# EAGLE design MRCS-BBProMini (EAGLE 7.7.0)
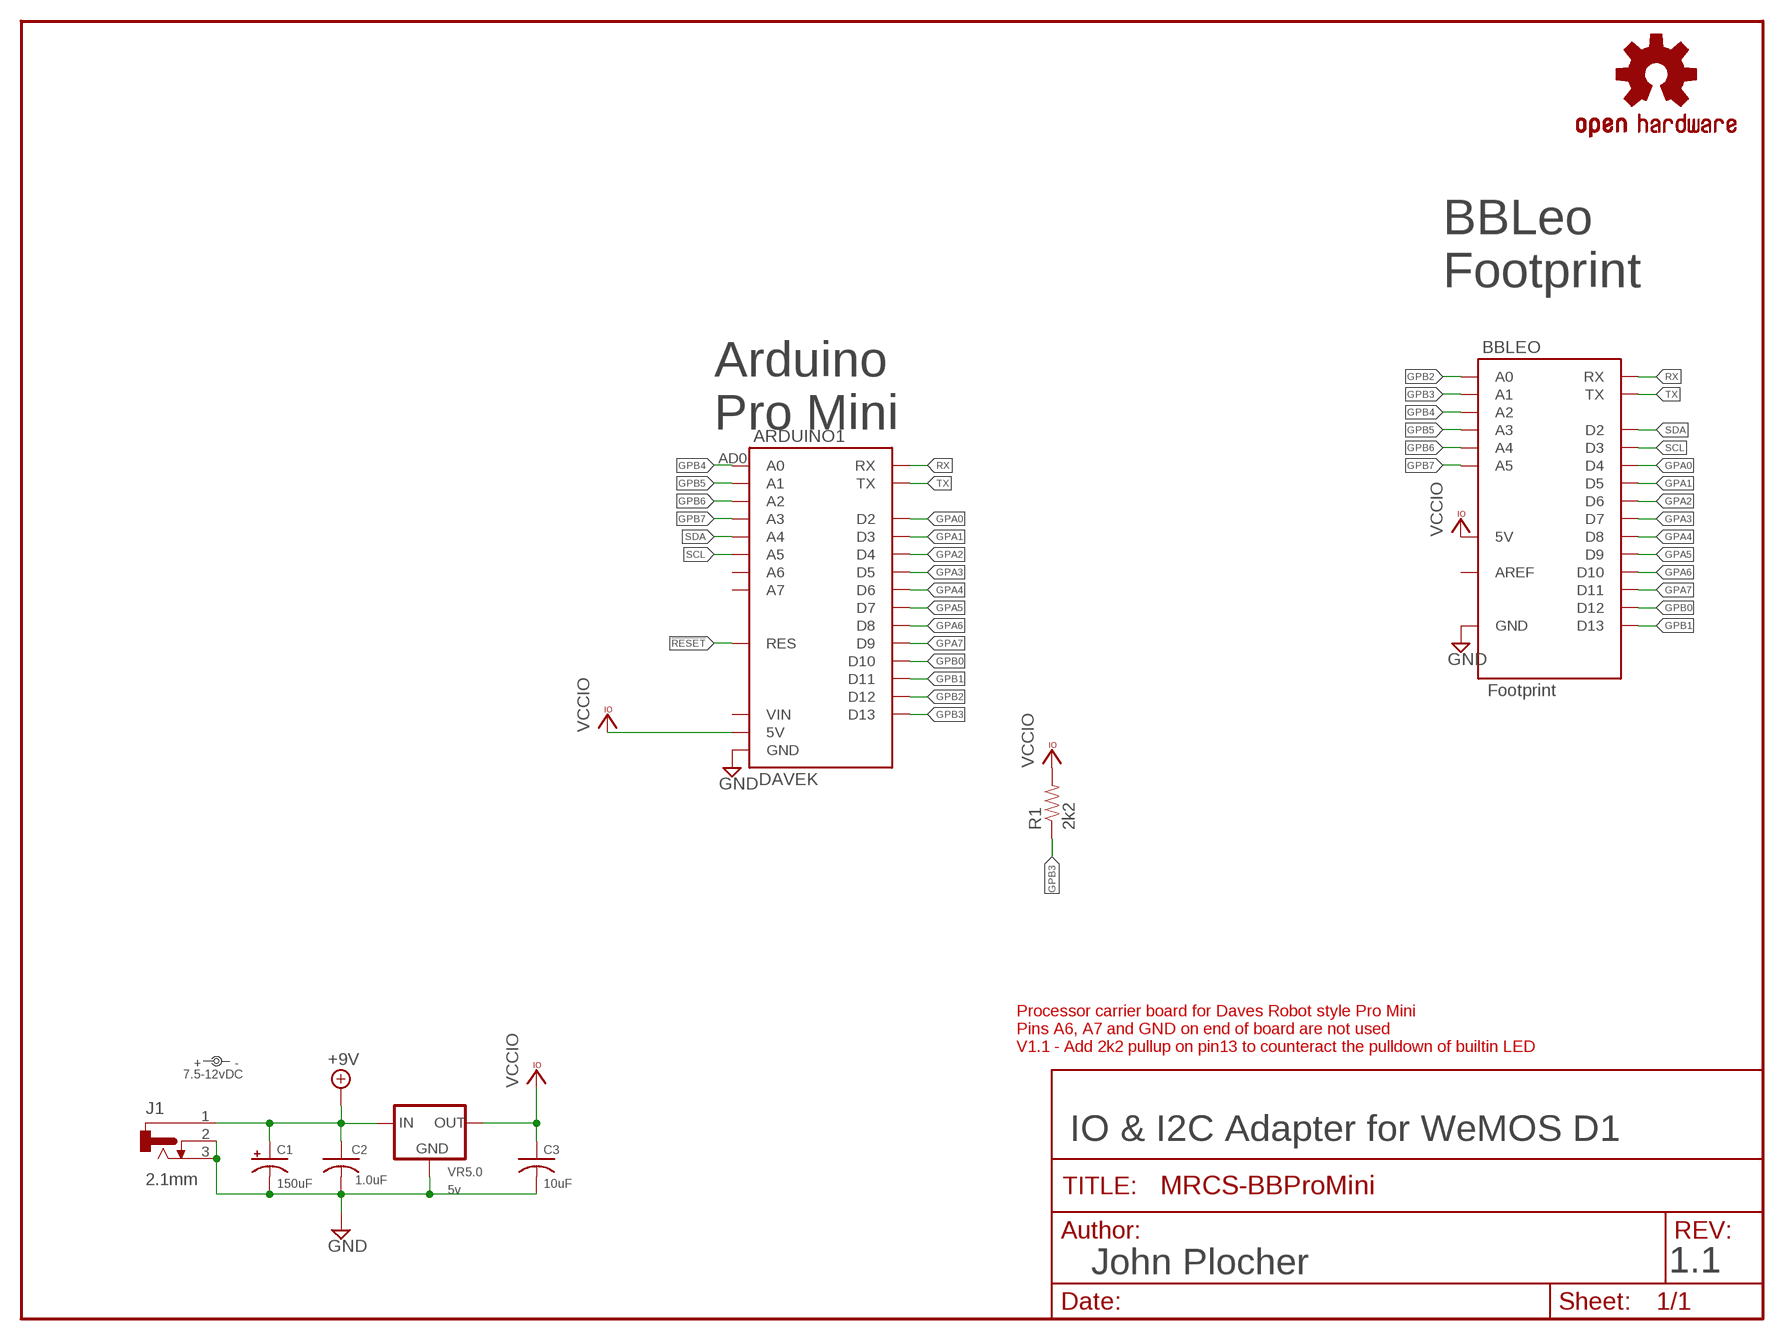
[diagram p0: schematic, sheet 1]

## Parts
ARDUINO1  DAVEK  ARDUINO-PRO-MINIDAVESROBOT  [ARDUINO_PRO_MINI_DAVEK]
BBLEO  Footprint  ARDUINO-BBLEO  [ARDUINO-BBLEO]
C1  150uF  CAP-POLPTH-5MM  [E5-10.5]
C2  1.0uF  CAPPTH1  [C050-024X044]
C3  10uF  CAPPTH1  [C050-024X044]
J1  2.1mm  CONNECTOR-DC-POWER-RA  [DCJ0202]
LABEL1  7.5-12vDC  DOC-POWER_LABEL  [PWR_LABEL]
OSHW1  OSHW  DOC-OSHW-LOGO-M  [OSHW-LOGO-M]
R1  2k2  RPTH03  [AXIAL-0.3-RES]
VR5.0  5v  VREG-PTH-RA-  [TO-220-RA]

## Nets
!RESET: ARDUINO1.RES ARDUINO1.RES@1(RES)
+9V [Feed]: C1.+ C2.1 J1.1 VR5.0.IN
GND [signals]: ARDUINO1.GND@1(GND) ARDUINO1.GND@2(GND) ARDUINO1.GND@4(GND) BBLEO.GND@0(GND) BBLEO.GND@1(GND) BBLEO.GND@2(GND) BBLEO.GND@3(GND) BBLEO.GND@4(GND) C1.- C2.2 C3.2 J1.2 J1.3 VR5.0.GND
GPA0: ARDUINO1.D2 BBLEO.D4
GPA1: ARDUINO1.D3 BBLEO.D5
GPA2: ARDUINO1.D4 BBLEO.D6
GPA3: ARDUINO1.D5 BBLEO.D7
GPA4: ARDUINO1.D6 BBLEO.D8
GPA5: ARDUINO1.D7 BBLEO.D9
GPA6: ARDUINO1.D8 BBLEO.D10
GPA7: ARDUINO1.D9 BBLEO.D11
GPB0: ARDUINO1.D10 BBLEO.D12
GPB1: ARDUINO1.D11 BBLEO.D13
GPB2: ARDUINO1.D12 BBLEO.A0
GPB3: ARDUINO1.D13 BBLEO.A1 R1.P$1
GPB4: ARDUINO1.AD0(A0) BBLEO.A2
GPB5: ARDUINO1.AD1(A1) BBLEO.A3
GPB6: ARDUINO1.AD2(A2) BBLEO.A4
GPB7: ARDUINO1.AD3(A3) BBLEO.A5
RX [signals]: ARDUINO1.RX BBLEO.RX
SCL [signals]: ARDUINO1.AD5(A5) BBLEO.SCL(D3)
SDA [signals]: ARDUINO1.AD4(A4) BBLEO.SDA(D2)
TX [signals]: ARDUINO1.TX@1(TX) BBLEO.TX
VCCIO [Power]: ARDUINO1.5V BBLEO.+5V@1(5V) BBLEO.+5V@2(5V) BBLEO.+5V@3(5V) BBLEO.+5V@4(5V) C3.1 R1.P$2 VR5.0.OUT
Unconnected: ARDUINO1.AD6(A6) ARDUINO1.AD7(A7) ARDUINO1.VIN BBLEO.AR(AREF)

## Notes on the sheet
- BBLeo
  Footprint
- Arduino
  Pro Mini
- Processor carrier board for Daves Robot style Pro Mini
- Pins A6, A7 and GND on end of board are not used
- V1.1 - Add 2k2 pullup on pin13 to counteract the pulldown of builtin LED
- IO & I2C Adapter for WeMOS D1
- John Plocher | 1.1

## Library data of the parts
ARDUINO1 = SPCoast:ARDUINO-PRO-MINI
BBLEO = SPCoast:ARDUINO-BBLEO
C1 = SPCoast:CAP-POL*
C2 C3 = SPCoast:CAP*
J1 = SPCoast:CONNECTOR-DC-POWER: DC POWER JACK
LABEL1 = SPCoast:DOC-POWER_LABEL
OSHW1 = SPCoast:DOC-OSHW-LOGO-: Open Source Hardware Logo This logo indicates the piece of hardware it is found on incorporates a OSHW license and/or adheres to the definition of open source hardware http://freedomdefined.org/OSHW Creative Commons - Attribution - ShareAlike 3.0
R1 = SPCoast:R*: Resistor Basic schematic elements and footprints for 0603, 1206, and PTH 1/10th watt (small) resistors.
VR5.0 = SPCoast:VREG-?-*: Voltage Regulator Standard linear regulator. 7805 uses IGO pinout LM1117 uses GOI pinout

## Net classes
0 default: width 0.254 mm, drill 0.5 mm, clearance 0.203 mm
1 Power: width 0.254 mm, drill 0.8 mm, clearance 0.254 mm
2 signals: width 0.254 mm, drill 0.6 mm, clearance 0.254 mm
3 Feed: width 1.016 mm, drill 1.4 mm, clearance 0.254 mm

## Board
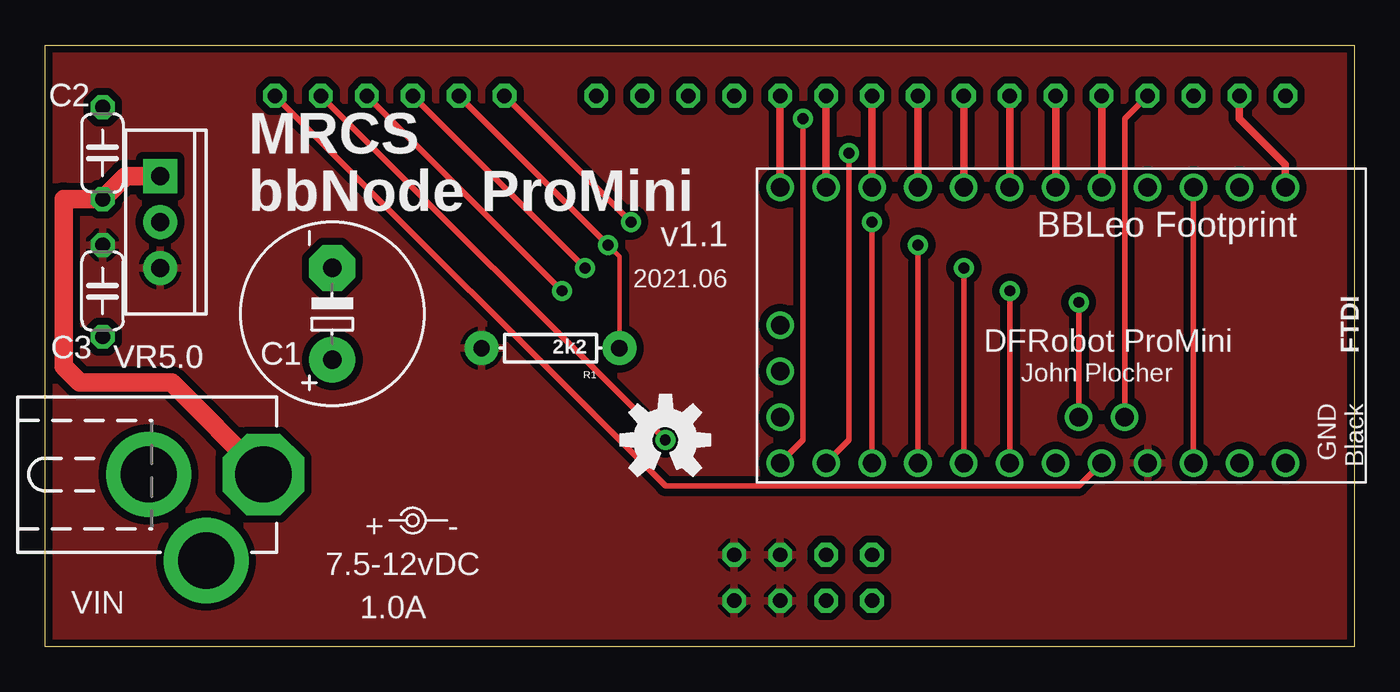
[diagram p1: board, top side]
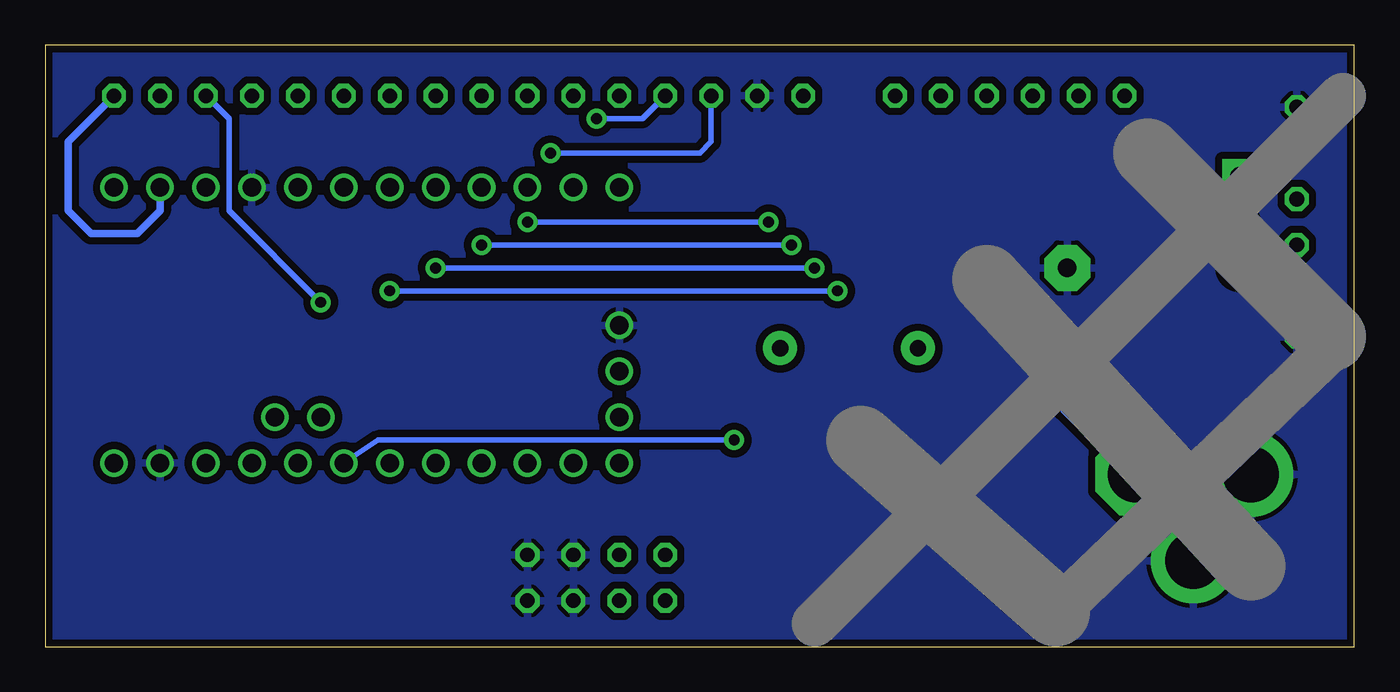
[diagram p2: board, bottom side, seen from below]

Size 72.39 x 33.27 mm. Coordinates in mm from the lower left corner, seen from the top.
Outline: 0,0 0,33.27 72.39,33.27 72.39,0 0,0
Copper layers (1*16): Top 0.035mm / dielectric 1.5mm / Bottom 0.035mm
Design rules "Fusion_eagle_rule_v1.1 *": minimum track width 8mil, minimum drill 0.6mm, track to track 6mil, track to pad 6mil, pad to pad 10mil, via to via 10mil, smd to smd 10mil, copper to edge 10mil, drill to drill 10mil, minimum pad ring 10mil, minimum via ring 10mil, stop-mask expansion 2mil, vias tented up to drill 100mil, thermal gap 10mil

### Footprints (pad centres in the part's own frame; a part is rotated, then mirrored left to right if it is on the bottom)
ARDUINO_PRO_MINI_DAVEK = drill 1.016: 5V 16.51,21.59; AD0 16.51,11.43; AD1 16.51,13.97; AD2 16.51,16.51; AD3 16.51,19.05; AD4 13.97,17.78; AD5 13.97,20.32; AD6 11.43,1.27; AD7 13.97,1.27; D2 1.27,19.05; D3 1.27,16.51; D4 1.27,13.97; D5 1.27,11.43; D6 1.27,8.89; D7 1.27,6.35; D8 1.27,3.81; D9 1.27,1.27; D10 16.51,1.27; D11 16.51,3.81; D12 16.51,6.35; D13 16.51,8.89; GND@1 16.51,26.67; GND@2 8.89,1.27; GND@4 1.27,21.59; RES 16.51,24.13; RES@1 1.27,24.13; RX 1.27,26.67; TX@1 1.27,29.21; VIN 16.51,29.21
ARDUINO-BBLEO = drill 0.8 octagon: +5V@1 40.64,5.08; +5V@2 40.64,2.54; +5V@3 38.1,5.08; +5V@4 38.1,2.54; A0 25.4,30.48; A1 22.86,30.48; A2 20.32,30.48; A3 17.78,30.48; A4 15.24,30.48; A5 12.7,30.48; AR 30.48,30.48; D4 58.42,30.48; D5 55.88,30.48; D6 53.34,30.48; D7 50.8,30.48; D8 48.26,30.48; D9 45.72,30.48; D10 43.18,30.48; D11 40.64,30.48; D12 38.1,30.48; D13 35.56,30.48; GND@0 33.02,30.48; GND@1 43.18,5.08; GND@2 45.72,5.08; GND@3 43.18,2.54; GND@4 45.72,2.54; RX 68.58,30.48; SCL 60.96,30.48; SDA 63.5,30.48; TX 66.04,30.48
E5-10.5 = drill 1.016 pad 2.54: + -2.54,0 | drill 1.016 pad 2.54 octagon: - 2.54,0
C050-024X044 = drill 0.813 octagon: 1 -2.54,0; 2 2.54,0
DCJ0202 = drill 3.1 pad 4.5 octagon: 1 0,3.175 | drill 3.1 pad 4.7: 2 4.763,0; 3 0,-3.175
AXIAL-0.3-RES = drill 0.9 pad 1.88: P$1 -3.81,0; P$2 3.81,0
TO-220-RA = drill 1 pad 1.88: GND 0,0; OUT 2.54,0 | drill 1 pad 1.88 square: IN -2.54,0

### Placement (x,y rotation side)
ARDUINO1  39.37,26.67 270 top
BBLEO  0,0 0 top
C1  15.88,18.41 90 top
C2  3.17,27.3 90 top
C3  3.17,19.68 270 top
J1  8.89,9.53 270 top
LABEL1  20.32,6.99 90 top
OSHW1  34.29,11.43 0 top
R1  27.94,16.51 180 top
VR5.0  6.35,23.5 270 top

### Tracks (layer width: path | path; a pad name or v marks a point on that pad's centre or on a via)
!RESET
  Top 0.305: ARDUINO1.RES@1 ARDUINO1.RES
+9V
  Top 1.016: VR5.0.IN 4.45,26.04 C2.1 1.02,24.77 1.02,15.49 1.91,14.61 6.99,14.61 J1.1
  Bottom 1.016: J1.1 15.88,13.34 C1.+
GND
  pour Bottom (isolate 0.406, rank 2): 72.14,0.2 72.14,32.77 0.2,32.77 0.2,0.2
GPA0
  Top 0.406: ARDUINO1.D2 BBLEO.D4
GPA1
  Top 0.406: ARDUINO1.D3 BBLEO.D5
GPA2
  Top 0.406: ARDUINO1.D4 BBLEO.D6
GPA3
  Top 0.406: ARDUINO1.D5 BBLEO.D7
GPA4
  Top 0.406: ARDUINO1.D6 BBLEO.D8
GPA5
  Top 0.406: ARDUINO1.D7 BBLEO.D9
GPA6
  Top 0.406: ARDUINO1.D8 BBLEO.D10
GPA7
  Top 0.406: ARDUINO1.D9 BBLEO.D11
GPB0  (via drill 0.6)
  Top 0.305: v41.91,29.21 41.91,11.43 ARDUINO1.D10
  Bottom 0.305: BBLEO.D12 39.37,29.21 v41.91,29.21
GPB1  (via drill 0.6)
  Top 0.305: v44.45,27.3 44.45,11.43 ARDUINO1.D11
  Bottom 0.305: BBLEO.D13 35.56,27.94 36.2,27.3 v44.45,27.3
GPB2  (via drill 0.6)
  Top 0.305: BBLEO.A0 v32.38,23.5 | v45.72,23.5 ARDUINO1.D12
  Bottom 0.305: v32.38,23.5 v45.72,23.5
GPB3  (via drill 0.6)
  Top 0.254: v31.11,22.23 31.75,21.59 R1.P$1
  Top 0.305: BBLEO.A1 v31.11,22.23 | v48.26,22.23 ARDUINO1.D13
  Bottom 0.305: v31.11,22.23 v48.26,22.23
GPB4  (via drill 0.6)
  Top 0.305: BBLEO.A2 v29.84,20.95 | v50.8,20.95 ARDUINO1.AD0
  Bottom 0.305: v29.84,20.95 v50.8,20.95
GPB5  (via drill 0.6)
  Top 0.305: BBLEO.A3 v28.57,19.68 | v53.34,19.68 ARDUINO1.AD1
  Bottom 0.305: v28.57,19.68 v53.34,19.68
GPB6  (via drill 0.6)
  Top 0.305: BBLEO.A4 v34.29,11.43
  Bottom 0.305: v34.29,11.43 53.98,11.43 ARDUINO1.AD2
GPB7
  Top 0.305: BBLEO.A5 34.29,8.89 57.15,8.89 ARDUINO1.AD3
RX
  Bottom 0.406: ARDUINO1.RX 66.04,24.13 67.31,22.86 69.85,22.86 71.12,24.13 71.12,27.94 BBLEO.RX
SCL
  Top 0.305: ARDUINO1.AD5 59.69,29.21 BBLEO.SCL
SDA  (via drill 0.6)
  Top 0.305: v57.15,19.05 ARDUINO1.AD4
  Bottom 0.305: BBLEO.SDA 62.23,29.21 62.23,24.13 v57.15,19.05
TX
  Top 0.406: BBLEO.TX 66.04,29.21 68.58,26.67 ARDUINO1.TX@1
VCCIO
  pour Top (isolate 0.406, rank 2): 72.14,0.2 72.14,32.77 0.2,32.77 0.2,0.2

### Text on the board
tPlace: MRCS | bbNode ProMini | BBLeo Footprint | v1.1 | 2021.06 | DFRobot ProMini | John Plocher | VIN | 1.0A
bDocu: Model Railroading is fun! | Made in the PCR, / Coast Division, NMRA | Go Bears! | bbNode / Pro Mini | For use with DFRobot Pro Mini | MRCS | www. SP Coast .com
_tNames: C2 | VR5.0 | C1 | C3 | R1